# EAGLE board mcs-1-32 (EAGLE 6.5.0)
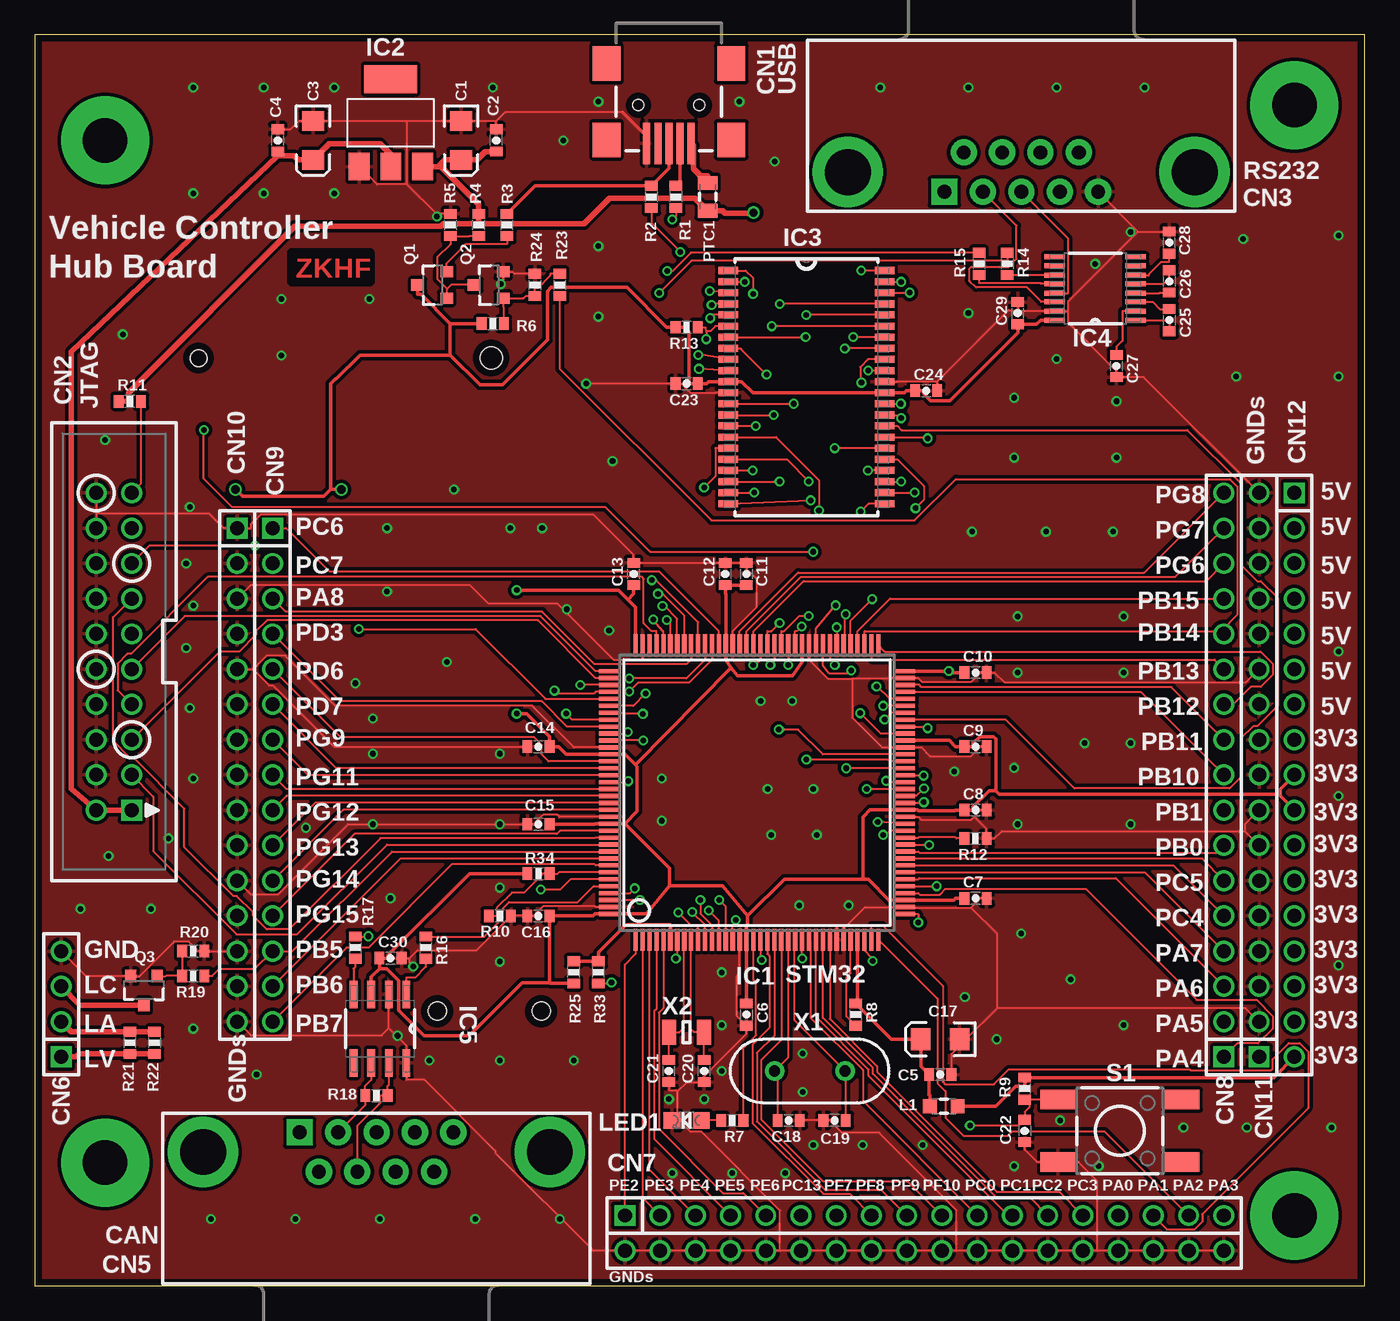
[diagram p2: board, top side]
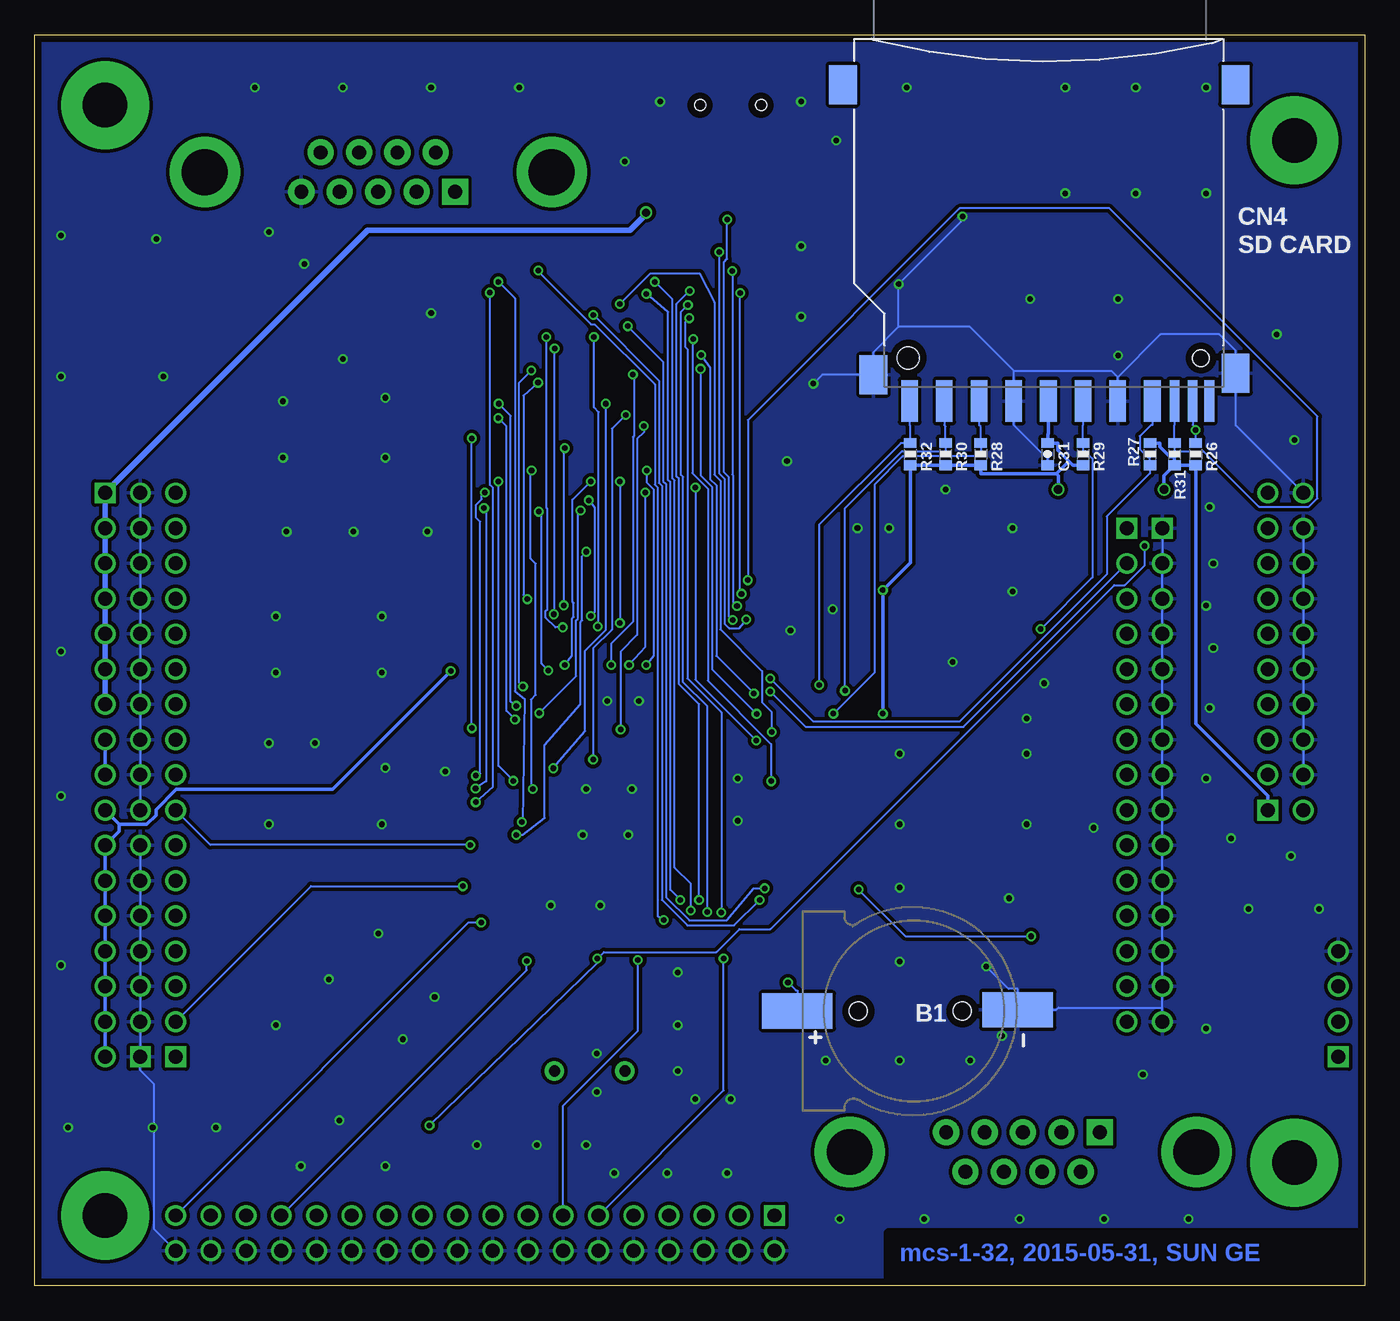
[diagram p3: board, bottom side, seen from below]

Size 95.89 x 90.17 mm. Coordinates in mm from the lower left corner, seen from the top.
Outline: 0,0 95.89,0 95.89,90.17 0,90.17 0,0
Copper layers (1*16): Top 0.035mm / dielectric 1.53mm / Bottom 0.035mm
Design rules "default": minimum track width 6mil, minimum drill 0.4mm, track to track 6mil, track to pad 6mil, pad to pad 6mil, via to via 6mil, smd to smd 5mil, copper to edge 0.5mm, drill to drill 0.5mm, minimum pad ring 0.15mm, minimum via ring 0.15mm, stop-mask expansion 4mil, vias tented up to drill 16mil, thermal gap 10mil
Net classes: 0 default: width 0.152 mm; 1 power_in: width 0.406 mm; 2 power: width 0.254 mm
tRestrict: 4 lines
bRestrict: 4 lines

## Footprints (pad centres in the part's own frame; a part is rotated, then mirrored left to right if it is on the bottom)
1220-SMD = smd 5.08 x 2.54: + 8.4,0; - -7.5,-0.1 | hole 1.3: 4,0; -3.5,0
EIA3216 = smd 1.4 x 1.6: A 1.4,0; C -1.4,0
0603-CAP = smd 0.7 x 0.9: 1 -0.8,0; 2 0.8,0
USB-MINIB = smd 3 x 0.5: D+ 2.75,0; D- 2.75,0.8; GND 2.75,-1.6; ID 2.75,-0.8; VBUS 2.75,1.6 | smd 2.5 x 2: GND@1 -3,-4.5; GND@2 -3,4.5; GND@3 2.5,4.5; GND@4 2.5,-4.5 | hole 0.8: 0,2.2; 0,-2.2
JTAG-ARM = drill 1 square: 1 -11.43,-1.27 | drill 1: 2 -11.43,1.27; 3 -8.89,-1.27; 4 -8.89,1.27; 5 -6.35,-1.27; 6 -6.35,1.27; 7 -3.81,-1.27; 8 -3.81,1.27; 9 -1.27,-1.27; 10 -1.27,1.27; 11 1.27,-1.27; 12 1.27,1.27; 13 3.81,-1.27; 14 3.81,1.27; 15 6.35,-1.27; 16 6.35,1.27; 17 8.89,-1.27; 18 8.89,1.27; 19 11.43,-1.27; 20 11.43,1.27
DB9 = drill 1 pad 1.88 square: 1 -5.54,-1.42 | drill 1 pad 1.88: 2 -2.77,-1.42; 3 0,-1.42; 4 2.77,-1.42; 5 5.54,-1.42; 6 -4.15,1.42; 7 -1.38,1.42; 8 1.38,1.42; 9 4.15,1.42 | drill 3.3 pad 5.08: G1 -12.5,0; G2 12.5,0
06132 = smd 1.2 x 3: 1 19.9,1; 2 17.4,1; 3 14.9,1; 4 12.4,1; 5 9.9,1; 6 7.4,1; 7 4.9,1; 9 22.4,1 | smd 0.7 x 3: 8 3.3,1; CD 2,1; WP 0.8,1 | smd 2 x 2.8: GP -1.1,-21.8; GP2 27.2,-21.8; GP3 25,-0.9; GP4 -1.1,-1 | hole 1.2: 1.4,-2.1 | hole 1.6: 22.5,-2.1
DB9_MALE = drill 1 pad 1.88 square: 1 5.54,-1.42 | drill 1 pad 1.88: 2 2.77,-1.42; 3 0,-1.42; 4 -2.77,-1.42; 5 -5.54,-1.42; 6 4.15,1.42; 7 1.38,1.42; 8 -1.38,1.42; 9 -4.15,1.42 | drill 3.3 pad 5.08: G1 -12.5,0; G2 12.5,0
1X04_NS = drill 1 square: 1 -3.81,0 | drill 1: 2 -1.27,0; 3 1.27,0; 4 3.81,0
2X18U = drill 1 square: 1 0,0 | drill 1: 2 2.54,0; 3 5.08,0; 4 7.62,0; 5 10.16,0; 6 12.7,0; 7 15.24,0; 8 17.78,0; 9 20.32,0; 10 22.86,0; 11 25.4,0; 12 27.94,0; 13 30.48,0; 14 33.02,0; 15 35.56,0; 16 38.1,0; 17 40.64,0; 18 43.18,0; 19 0,-2.54; 20 2.54,-2.54; 21 5.08,-2.54; 22 7.62,-2.54; 23 10.16,-2.54; 24 12.7,-2.54; 25 15.24,-2.54; 26 17.78,-2.54; 27 20.32,-2.54; 28 22.86,-2.54; 29 25.4,-2.54; 30 27.94,-2.54; 31 30.48,-2.54; 32 33.02,-2.54; 33 35.56,-2.54; 34 38.1,-2.54; 35 40.64,-2.54; 36 43.18,-2.54
1X17M1 = drill 1 square: 1 0,0 | drill 1: 2 2.54,0; 3 5.08,0; 4 7.62,0; 5 10.16,0; 6 12.7,0; 7 15.24,0; 8 17.78,0; 9 20.32,0; 10 22.86,0; 11 25.4,0; 12 27.94,0; 13 30.48,0; 14 33.02,0; 15 35.56,0; 16 38.1,0; 17 40.64,0
1X15M1 = drill 1 square: 1 0,0 | drill 1: 2 2.54,0; 3 5.08,0; 4 7.62,0; 5 10.16,0; 6 12.7,0; 7 15.24,0; 8 17.78,0; 9 20.32,0; 10 22.86,0; 11 25.4,0; 12 27.94,0; 13 30.48,0; 14 33.02,0; 15 35.56,0
SQFP-S-20X20-144 = smd 0.3 x 1.6: 1 -8.75,-10.6; 2 -8.25,-10.6; 3 -7.75,-10.6; 4 -7.25,-10.6; 5 -6.75,-10.6; 6 -6.25,-10.6; 7 -5.75,-10.6; 8 -5.25,-10.6; 9 -4.75,-10.6; 10 -4.25,-10.6; 11 -3.75,-10.6; 12 -3.25,-10.6; 13 -2.75,-10.6; 14 -2.25,-10.6; 15 -1.75,-10.6; 16 -1.25,-10.6; 17 -0.75,-10.6; 18 -0.25,-10.6; 19 0.25,-10.6; 20 0.75,-10.6; 21 1.25,-10.6; 22 1.75,-10.6; 23 2.25,-10.6; 24 2.75,-10.6; 25 3.25,-10.6; 26 3.75,-10.6; 27 4.25,-10.6; 28 4.75,-10.6; 29 5.25,-10.6; 30 5.75,-10.6; 31 6.25,-10.6; 32 6.75,-10.6; 33 7.25,-10.6; 34 7.75,-10.6; 35 8.25,-10.6; 36 8.75,-10.6; 73 8.75,10.6; 74 8.25,10.6; 75 7.75,10.6; 76 7.25,10.6; 77 6.75,10.6; 78 6.25,10.6; 79 5.75,10.6; 80 5.25,10.6; 81 4.75,10.6; 82 4.25,10.6; 83 3.75,10.6; 84 3.25,10.6; 85 2.75,10.6; 86 2.25,10.6; 87 1.75,10.6; 88 1.25,10.6; 89 0.75,10.6; 90 0.25,10.6; 91 -0.25,10.6; 92 -0.75,10.6; 93 -1.25,10.6; 94 -1.75,10.6; 95 -2.25,10.6; 96 -2.75,10.6; 97 -3.25,10.6; 98 -3.75,10.6; 99 -4.25,10.6; 100 -4.75,10.6; 101 -5.25,10.6; 102 -5.75,10.6; 103 -6.25,10.6; 104 -6.75,10.6; 105 -7.25,10.6; 106 -7.75,10.6; 107 -8.25,10.6; 108 -8.75,10.6 | smd 1.6 x 0.3: 37 10.6,-8.75; 38 10.6,-8.25; 39 10.6,-7.75; 40 10.6,-7.25; 41 10.6,-6.75; 42 10.6,-6.25; 43 10.6,-5.75; 44 10.6,-5.25; 45 10.6,-4.75; 46 10.6,-4.25; 47 10.6,-3.75; 48 10.6,-3.25; 49 10.6,-2.75; 50 10.6,-2.25; 51 10.6,-1.75; 52 10.6,-1.25; 53 10.6,-0.75; 54 10.6,-0.25; 55 10.6,0.25; 56 10.6,0.75; 57 10.6,1.25; 58 10.6,1.75; 59 10.6,2.25; 60 10.6,2.75; 61 10.6,3.25; 62 10.6,3.75; 63 10.6,4.25; 64 10.6,4.75; 65 10.6,5.25; 66 10.6,5.75; 67 10.6,6.25; 68 10.6,6.75; 69 10.6,7.25; 70 10.6,7.75; 71 10.6,8.25; 72 10.6,8.75; 109 -10.6,8.75; 110 -10.6,8.25; 111 -10.6,7.75; 112 -10.6,7.25; 113 -10.6,6.75; 114 -10.6,6.25; 115 -10.6,5.75; 116 -10.6,5.25; 117 -10.6,4.75; 118 -10.6,4.25; 119 -10.6,3.75; 120 -10.6,3.25; 121 -10.6,2.75; 122 -10.6,2.25; 123 -10.6,1.75; 124 -10.6,1.25; 125 -10.6,0.75; 126 -10.6,0.25; 127 -10.6,-0.25; 128 -10.6,-0.75; 129 -10.6,-1.25; 130 -10.6,-1.75; 131 -10.6,-2.25; 132 -10.6,-2.75; 133 -10.6,-3.25; 134 -10.6,-3.75; 135 -10.6,-4.25; 136 -10.6,-4.75; 137 -10.6,-5.25; 138 -10.6,-5.75; 139 -10.6,-6.25; 140 -10.6,-6.75; 141 -10.6,-7.25; 142 -10.6,-7.75; 143 -10.6,-8.25; 144 -10.6,-8.75
BURR-BROWN_SOT223 = smd 1.499 x 2.007: 1 -2.261,-3.15; 2 0.025,-3.15; 3 2.311,-3.15 | smd 3.81 x 2.007: 4 0,3.15
SOP80P1176X120-44N = smd 1.397 x 0.508: 1 -5.639,8.407; 2 -5.639,7.595; 3 -5.639,6.807; 4 -5.639,5.994; 5 -5.639,5.207; 6 -5.639,4.394; 7 -5.639,3.607; 8 -5.639,2.794; 9 -5.639,2.007; 10 -5.639,1.194; 11 -5.639,0.406; 12 -5.639,-0.406; 13 -5.639,-1.194; 14 -5.639,-2.007; 15 -5.639,-2.794; 16 -5.639,-3.607; 17 -5.639,-4.394; 18 -5.639,-5.207; 19 -5.639,-5.994; 20 -5.639,-6.807; 21 -5.639,-7.595; 22 -5.639,-8.407; 23 5.639,-8.407; 24 5.639,-7.595; 25 5.639,-6.807; 26 5.639,-5.994; 27 5.639,-5.207; 28 5.639,-4.394; 29 5.639,-3.607; 30 5.639,-2.794; 31 5.639,-2.007; 32 5.639,-1.194; 33 5.639,-0.406; 34 5.639,0.406; 35 5.639,1.194; 36 5.639,2.007; 37 5.639,2.794; 38 5.639,3.607; 39 5.639,4.394; 40 5.639,5.207; 41 5.639,5.994; 42 5.639,6.807; 43 5.639,7.595; 44 5.639,8.407
SOP65P640X120-16N = smd 1.473 x 0.356: 1 -2.921,2.286; 2 -2.921,1.626; 3 -2.921,0.965; 4 -2.921,0.33; 5 -2.921,-0.33; 6 -2.921,-0.965; 7 -2.921,-1.626; 8 -2.921,-2.286; 9 2.921,-2.286; 10 2.921,-1.626; 11 2.921,-0.965; 12 2.921,-0.33; 13 2.921,0.33; 14 2.921,0.965; 15 2.921,1.626; 16 2.921,2.286
SOIC127P600X175-8N = smd 1.981 x 0.559: 1 -2.464,1.905; 2 -2.464,0.635; 3 -2.464,-0.635; 4 -2.464,-1.905; 5 2.464,-1.905; 6 2.464,-0.635; 7 2.464,0.635; 8 2.464,1.905
L2012C = smd 1 x 1: 1 -1,0; 2 1,0
CHIPLED_0805 = smd 1.2 x 1.2: A 0,-1.05; C 0,1.05
PTC0805 = smd 1 x 1.4: 1 -1,0; 2 1,0
SOT23-3 = smd 0.8 x 0.9: 1 -0.95,-1; 2 0.95,-1; 3 0,1.1
0603-RES = smd 0.7 x 0.9: 1 -0.8,0; 2 0.8,0
SWITCH-TACT_SFKHHM = smd 2.5 x 1.4: 1 -4.475,2.25; 2 -4.475,-2.25; 3 4.475,2.25; 4 4.475,-2.25
HC49US = drill 0.8 pad 1.422: 1 -2.54,0; 2 2.54,0
CRYSTAL-32KHZ-3215 = smd 1 x 1.8: 1 -1.25,0; 2 1.25,0

## Placement (x,y rotation side)
B1  3V  [1220-SMD]  32.51,19.81 180 bottom
C1  10u  [EIA3216]  30.73,82.55 270 top
C2  100n  [0603-CAP]  33.27,82.55 90 top
C3  10u  [EIA3216]  20.07,82.55 270 top
C4  100n  [0603-CAP]  17.53,82.55 90 top
C5  100n  [0603-CAP]  65.28,15.24 0 top
C6  100n  [0603-CAP]  51.31,19.56 270 top
C7  100n  [0603-CAP]  67.82,27.94 0 top
C8  100n  [0603-CAP]  67.82,34.29 0 top
C9  100n  [0603-CAP]  67.82,38.86 0 top
C10  100n  [0603-CAP]  67.82,44.2 0 top
C11  100n  [0603-CAP]  51.31,51.31 90 top
C12  100n  [0603-CAP]  49.78,51.31 90 top
C13  100n  [0603-CAP]  43.18,51.31 90 top
C14  100n  [0603-CAP]  36.32,38.86 180 top
C15  100n  [0603-CAP]  36.32,33.27 180 top
C16  100n  [0603-CAP]  36.32,26.67 180 top
C17  10u  [EIA3216]  65.28,17.78 180 top
C18  22p  [0603-CAP]  54.36,11.94 180 top
C19  22p  [0603-CAP]  57.66,11.94 0 top
C20  10p  [0603-CAP]  48.26,15.49 90 top
C21  10p  [0603-CAP]  45.72,15.49 90 top
C22  100n  [0603-CAP]  71.37,11.18 270 top
C23  100n  [0603-CAP]  46.99,65.02 180 top
C24  100n  [0603-CAP]  64.26,64.52 0 top
C25  100n  [0603-CAP]  81.79,69.6 270 top
C26  100n  [0603-CAP]  81.79,72.39 270 top
C27  100n  [0603-CAP]  77.98,66.29 270 top
C28  100n  [0603-CAP]  81.79,75.18 90 top
C29  100n  [0603-CAP]  70.87,70.1 90 top
C30  100n  [0603-CAP]  25.65,23.62 0 top
C31  100n  [0603-CAP]  22.86,59.94 270 bottom
CN1  USBSMD  [USB-MINIB]  45.72,85.09 270 top
CN2  JTAG-ARM-HDR100  [JTAG-ARM]  5.71,45.72 90 top
CN3  RS232  [DB9]  71.12,80.26 0 top
CN4  SDMMC06132  [06132]  10.41,64.77 180 bottom
CN5  CAN  [DB9_MALE]  24.64,9.65 180 top
CN6  LED_E  [1X04_NS]  1.91,20.32 90 top
CN7  HEADER-2X18  [2X18U]  42.55,5.08 0 top
CN8  PINHD-1X17  [1X17M1]  85.72,16.51 90 top
CN9  HEADER-1X15M1  [1X15M1]  17.14,54.61 270 top
CN10  HEADER-1X15M1  [1X15M1]  14.61,54.61 270 top
CN11  PINHD-1X17  [1X17M1]  88.27,16.51 90 top
CN12  PINHD-1X17  [1X17M1]  90.81,57.15 270 top
IC1  [SQFP-S-20X20-144]  52.07,35.56 0 top
IC2  AMS1117-3.3  [BURR-BROWN_SOT223]  25.65,83.82 0 top
IC3  IS62WV51216BLL-55TLI  [SOP80P1176X120-44N]  55.63,64.77 0 top
IC4  MAX3232CPWR  [SOP65P640X120-16N]  76.45,71.88 180 top
IC5  SN65HVD230DR  [SOIC127P600X175-8N]  24.89,18.54 270 top
L1  FB/10uH  [L2012C]  65.53,12.95 180 top
LED1  GREEN  [CHIPLED_0805]  46.99,11.94 90 top
PTC1  [PTC0805]  48.51,78.49 90 top
Q1  [SOT23-3]  28.7,72.14 90 top
Q2  [SOT23-3]  32.77,72.14 90 top
Q3  [SOT23-3]  7.87,21.34 180 top
R1  22R  [0603-RES]  46.23,78.49 270 top
R2  22R  [0603-RES]  44.45,78.49 270 top
R3  1K5  [0603-RES]  34.04,76.45 90 top
R4  10K  [0603-RES]  32,76.45 90 top
R5  36K/39K  [0603-RES]  29.97,76.45 270 top
R6  47K  [0603-RES]  33.02,69.34 180 top
R7  470R  [0603-RES]  50.29,11.94 180 top
R8  47R  [0603-RES]  59.18,19.56 270 top
R9  10K  [0603-RES]  71.37,14.22 90 top
R10  10K  [0603-RES]  33.53,26.67 0 top
R11  0R  [0603-RES]  6.86,63.75 0 top
R12  10K  [0603-RES]  67.82,32.26 180 top
R13  10K  [0603-RES]  46.99,69.09 180 top
R14  0R  [0603-RES]  70.1,73.66 270 top
R15  0R  [0603-RES]  68.07,73.66 270 top
R16  0R  [0603-RES]  28.19,24.38 270 top
R17  1K  [0603-RES]  23.11,24.38 270 top
R18  120R  [0603-RES]  24.64,13.72 180 top
R19  2K2  [0603-RES]  11.43,22.35 180 top
R20  1K  [0603-RES]  11.43,24.13 180 top
R21  [0603-RES]  6.86,17.53 270 top
R22  [0603-RES]  8.64,17.53 270 top
R23  0R/NP  [0603-RES]  37.85,72.14 270 top
R24  0R/NP  [0603-RES]  36.07,72.14 90 top
R25  0R/NP  [0603-RES]  38.86,22.61 90 top
R26  10K  [0603-RES]  12.19,59.94 270 bottom
R27  10K  [0603-RES]  15.49,59.94 90 bottom
R28  10K  [0603-RES]  27.69,59.94 270 bottom
R29  10K  [0603-RES]  20.32,59.94 270 bottom
R30  10K  [0603-RES]  30.23,59.94 270 bottom
R31  10K  [0603-RES]  13.72,59.94 270 bottom
R32  10K  [0603-RES]  32.77,59.94 270 bottom
R33  0R/NP  [0603-RES]  40.64,22.61 90 top
R34  0R/NP  [0603-RES]  36.32,29.72 180 top
S1  [SWITCH-TACT_SFKHHM]  78.23,11.18 0 top
X1  8M  [HC49US]  55.88,15.49 180 top
X2  32768  [CRYSTAL-32KHZ-3215]  46.99,18.29 0 top

## Tracks (layer width: path | path; a pad name or v marks a point on that pad's centre or on a via)
!RST  (via drill 0.4 pad 0.7)
  Top 0.152: v15.88,53.34 8.26,53.34 CN2.15 | S1.1 72.06,13.43 72.05,13.42 71.71,13.42 | R9.1 71.71,13.42 | 71.71,13.42 71.71,12.89 71.37,12.55 71.37,12.18 C22.1 70.97,11.57 v67.42,11.57 | v55.32,23.6 IC1.25
  Bottom 0.152: v15.88,53.34 15.88,51.94 17.31,50.51 18.07,50.51 42.85,25.72 45.08,25.72 46.74,24.07 54.86,24.07 v55.32,23.6 55.32,23.29 v67.42,11.57
+5V  (via drill 0.6)
  Top 0.406: R11.1 6.76,63.75 6.76,64.37 18.75,76.35 29.29,76.35 29.49,76.55 32,76.55 | C2.1 32.47,81.75 31.89,81.17 31.89,81.15 C1.A 29.58,81.15 29.2,80.77 | 29.2,80.77 32,77.96 R4.2 32,76.55 | IC2.3 29.1,80.67 29.2,80.77 | 32,76.55 39.59,76.55 41.44,78.39 47.61,78.39 PTC1.1 49.57,77.49 49.75,77.31 51.78,77.31 v51.82,77.34
  Bottom 0.406: CN12.7 CN12.6 CN12.5 CN12.4 CN12.3 CN12.2 CN12.1 71.88,76.07 52.96,76.07 51.82,77.22 v51.82,77.34
A0  (via drill 0.4 pad 0.7)
  Top 0.152: IC1.10 47.82,25.99 47.33,25.99 v46.39,26.92 | IC3.5 48.94,69.98 v48.7,69.74
  Bottom 0.152: v48.7,69.74 48.99,69.45 48.99,67.67 48.84,67.51 48.84,43.78 46.39,41.34 v46.39,26.92
A1  (via drill 0.4 pad 0.7)
  Top 0.152: IC3.4 48.86,70.76 v48.8,70.7 | IC1.11 48.32,26.03 v47.4,26.95
  Bottom 0.152: v47.4,26.95 47.4,41.76 49.14,43.51 49.14,58.3 49.3,58.46 49.3,70.2 v48.8,70.7
A2  (via drill 0.4 pad 0.7)
  Top 0.152: v47.99,27.82 47.99,26.83 48.82,26 IC1.12 | IC3.3 v48.67,71.7
  Bottom 0.152: v47.99,27.82 47.99,41.92 49.45,43.38 49.45,58.17 49.6,58.33 49.6,70.77 v48.67,71.7
A3  (via drill 0.4 pad 0.7)
  Top 0.152: IC3.2 v51.18,72.36 | IC1.13 49.32,26.33 v48.58,27.07
  Bottom 0.152: v48.58,27.07 48.58,28.98 49.75,30.15 49.75,58.05 49.91,58.2 49.91,71.09 v51.18,72.36
A4  (via drill 0.4 pad 0.7)
  Top 0.152: IC3.1 51.25,73.18 51.79,72.64 v51.79,71.5 | IC1.14 49.82,27.34 v49.34,27.82
  Bottom 0.152: v49.34,27.82 50.06,28.54 50.06,57.92 50.21,58.08 50.21,70.18 v51.79,71.5
A5  (via drill 0.4 pad 0.7)
  Top 0.152: IC3.44 v59.57,73.18 | IC1.15 50.32,25.89 v50.54,26.37
  Bottom 0.152: v59.57,73.18 59.57,73.09 55.78,69.3 55.52,69.3 51.19,64.97 51.19,57.75 50.97,57.54 50.97,26.67 v50.54,26.37
A6  (via drill 0.4 pad 0.7)
  Top 0.152: IC1.50 v60.76,33.44 | IC3.43 v62.45,72.36
  Bottom 0.152: v62.45,72.36 61.27,71.17 61.27,42.87 60.57,42.3 60.7,33.37 v60.76,33.44
A7  (via drill 0.4 pad 0.7)
  Top 0.152: IC3.42 v63.07,71.58 | IC1.53 63.91,34.81 v64.09,34.87
  Bottom 0.152: v64.09,34.87 62.86,35.98 62.86,57.52 63.07,57.73 v63.07,71.58
A8  (via drill 0.4 pad 0.7)
  Top 0.152: IC3.27 62.19,59.56 64.09,57.66 64.09,56.64 v63.5,56.05 | v64.1,35.85 63.56,35.31 IC1.54
  Bottom 0.152: v63.5,56.05 63.34,55.89 63.34,36.36 v64.1,35.85
A9  (via drill 0.4 pad 0.7)
  Top 0.152: IC1.55 v59.98,35.81 | IC3.26 v60.07,58.78
  Bottom 0.152: v60.07,58.78 60.13,58.71 60.13,52.41 59.77,52.06 59.77,42.59 60.1,42.26 60.1,35.94 v59.98,35.81
A10  (via drill 0.4 pad 0.7)
  Top 0.152: IC1.56 61.47,36.31 v61.38,36.4 | IC3.25 v62.45,57.96
  Bottom 0.152: v61.38,36.4 62.45,37.48 v62.45,57.96
A11  (via drill 0.4 pad 0.7)
  Top 0.152: IC1.57 63.91,36.81 v64.07,36.77 | IC3.24 v63.44,57.17
  Bottom 0.152: v64.07,36.77 63.78,36.94 63.78,55.08 64.08,55.38 64.08,56.29 63.65,56.71 | 63.65,56.71 | 63.65,56.71 63.65,56.96 v63.44,57.17
A12  (via drill 0.4 pad 0.7)
  Top 0.152: IC1.87 53.82,47.19 54.02,47.19 55.12,48.29 v55.8,48.29 | IC3.22 v55.93,56.62
  Bottom 0.152: v55.93,56.62 55.53,56.09 55.53,48.56 v55.8,48.29
A13  (via drill 0.4 pad 0.7)
  Top 0.152: IC1.88 53.32,45.13 53.28,45.13 v53.03,44.75 | IC3.21 v51.87,57.17
  Bottom 0.152: v53.03,44.75 51.87,46.05 v51.87,57.17
A14  (via drill 0.4 pad 0.7)
  Top 0.152: IC1.89 52.82,47.19 53.1,47.19 v53.7,47.79 | IC3.20 v53.7,57.96
  Bottom 0.152: v53.7,57.96 v53.7,47.79
A15  (via drill 0.4 pad 0.7)
  Top 0.152: IC1.90 52.32,45.13 52.06,44.88 v51.8,44.75 | IC3.19 v51.76,58.78
  Bottom 0.152: v51.76,58.78 51.76,57.9 51.28,57.41 51.28,45.4 v51.8,44.75
A16  (via drill 0.4 pad 0.7)
  Top 0.152: IC1.80 57.32,45.13 57.42,45.13 v57.68,44.75 | IC3.18 54.21,59.56 v55.8,57.97
  Bottom 0.152: v57.68,44.75 57.15,45.41 57.15,48.09 57.03,48.21 57.03,49.21 57.11,49.3 57.11,56.66 v55.8,57.97
A17  (via drill 0.4 pad 0.7)
  Top 0.152: IC3.23 60.12,56.36 v59.55,55.8 | 58.66,44.29 v58.85,44.36 58.66,44.16 57.27,44.16 56.82,44.73 IC1.81
  Bottom 0.152: v58.85,44.36 59.35,44.85 59.35,55.59 v59.55,55.8
A18  (via drill 0.4 pad 0.7)
  Top 0.152: IC1.82 56.32,47.38 v57.74,49.05 | IC3.28 v57.68,60.38
  Bottom 0.152: v57.74,49.05 57.74,60.06 v57.68,60.38
D0  (via drill 0.4 pad 0.7)
  Top 0.152: IC1.85 54.82,47.19 54.94,47.19 v55.29,47.53 | IC3.7 v55.57,68.38
  Bottom 0.152: v55.29,47.53 55.22,47.6 55.22,62.97 55.57,63.31 v55.57,68.38
D1  (via drill 0.4 pad 0.7)
  Top 0.152: IC3.8 50.91,67.56 50.91,67.52 v52.76,65.68 | IC1.86 54.32,44.88 v54.32,44.75
  Bottom 0.152: v52.76,65.68 52.66,65.59 52.66,61.25 52.76,61.16 52.76,47.86 54.32,46.3 v54.32,44.75
D2  (via drill 0.4 pad 0.7)
  Top 0.152: v44.04,42.7 43.15,41.81 IC1.114 | IC3.9 47.89,67.16 v47.84,67.08
  Bottom 0.152: v47.84,67.08 47.19,66.18 47.19,58.15 46.75,57.71 46.75,45.41 v44.04,42.7
D3  (via drill 0.4 pad 0.7)
  Top 0.152: IC1.115 42.5,41.31 42.58,41.23 v43.85,41.23 | IC3.10 v47.89,66.09
  Bottom 0.152: v47.89,66.09 47.89,58.41 47.06,57.59 47.06,44.45 v43.85,41.23
D4  (via drill 0.4 pad 0.7)
  Top 0.152: IC3.13 v54.71,63.58 | IC1.58 v58.5,37.31
  Bottom 0.152: v58.5,37.31 56.21,39.98 56.21,45.79 54.71,47.29 v54.71,63.58
D5  (via drill 0.4 pad 0.7)
  Top 0.152: IC1.59 61.64,37.81 61.52,37.93 v55.63,37.93 | IC3.14 v53.28,62.76
  Bottom 0.152: v53.28,62.76 54.27,61.77 54.27,47.3 55.63,45.94 v55.63,37.93
D6  (via drill 0.4 pad 0.7)
  Top 0.152: IC1.60 56.82,38.31 55.03,40.1 v53.65,40.1 | IC3.15 v51.97,61.98
  Bottom 0.152: v51.97,61.98 51.97,61.52 52.45,61.04 52.45,46.92 53.65,45.72 v53.65,40.1
D7  (via drill 0.4 pad 0.7)
  Top 0.152: IC3.16 53.44,61.16 56.53,58.07 v56.53,55.88 | IC1.63 60.99,39.81 v59.52,41.28
  Bottom 0.152: v59.52,41.28 56.85,43.95 | 56.85,43.95 | 56.85,43.95 56.85,47.96 56.73,48.08 56.73,55.69 v56.53,55.88
D8  (via drill 0.4 pad 0.7)
  Top 0.152: IC1.64 64.27,40.31 v64.38,40.2 | IC3.29 64.3,61.16 v64.38,61.08
  Bottom 0.152: v64.38,40.2 v64.38,61.08
D9
  Top 0.152: IC3.30 62.19,61.98 62.49,61.68 83.11,61.68 87.02,57.77 87.02,51.91 88.12,50.8 88.39,50.8 89.61,49.59 89.61,41.82 88.13,40.35 87.85,40.35 87,39.5 87,36.71 86.14,35.85 74.96,35.85 70,40.81 IC1.65
D10  (via drill 0.4 pad 0.7)
  Top 0.152: IC1.66 61.64,41.31 61.64,41.2 v61.26,40.83 | IC3.31 62.23,62.76 v62.45,62.54
  Bottom 0.152: v61.26,40.83 61.88,41.44 61.88,61.96 v62.45,62.54
D11  (via drill 0.4 pad 0.7)
  Top 0.152: IC3.32 v62.44,63.58 | IC1.67 v61.17,41.81
  Bottom 0.152: v61.17,41.81 61.57,42.08 61.57,62.71 v62.44,63.58
D12  (via drill 0.4 pad 0.7)
  Top 0.152: IC3.35 v60.09,65.96 | IC1.68 61.64,42.31 60.76,43.2 v60.69,43.2
  Bottom 0.152: v60.69,43.2 60.96,43.47 60.96,65.09 v60.09,65.96
D13  (via drill 0.4 pad 0.7)
  Top 0.152: IC1.77 58.82,47.95 v60.37,49.49 | IC3.36 60.07,66.78 59.51,66.22 59.51,65.31 v59.6,65.09
  Bottom 0.152: v59.6,65.09 60.65,64.16 60.65,49.78 v60.37,49.49
D14  (via drill 0.4 pad 0.7)
  Top 0.152: IC3.37 v58.41,67.56 | IC1.78 58.41,46.25 58.41,48.35 v58.46,48.41
  Bottom 0.152: v58.46,48.41 58.41,48.46 v58.41,67.56
D15  (via drill 0.4 pad 0.7)
  Top 0.152: v57.82,47.47 IC1.79 | IC3.38 v59,68.38
  Bottom 0.152: v57.82,47.47 58.34,47.47 59.04,48.17 59.04,48.65 58.93,48.76 58.93,56 59,56.07 v59,68.38
FSMC_NBL0  (via drill 0.4 pad 0.7)
  Top 0.152: IC1.141 42.91,28.31 v43.26,28.66 | IC3.39 v53.14,69.16
  Bottom 0.152: v53.14,69.16 50.58,66.6 50.58,58.01 50.36,57.79 50.36,28.01 48.69,26.34 45.98,26.34 44.04,28.66 v43.26,28.66
FSMC_NBL1  (via drill 0.4 pad 0.7)
  Top 0.152: IC1.142 42.5,27.81 v43.63,27.81 | IC3.40 v55.62,69.98
  Bottom 0.152: v55.62,69.98 50.88,65.24 50.88,57.88 50.67,57.67 50.67,27.82 48.84,25.98 45.46,25.98 v43.63,27.81
FSMC_NE3  (via drill 0.4 pad 0.7)
  Top 0.152: R13.1 48.37,69.09 48.37,68.92 48.47,68.82 | IC1.125 42.5,36.31 42.57,36.38 v42.79,36.38 | IC3.6 49.06,69.16 48.71,68.82 48.47,68.82 | 48.47,68.82 48.41,68.76 v48.41,68.23
  Bottom 0.152: v48.41,68.23 48.47,68.17 48.47,58.57 47.36,57.46 47.36,43.62 | 47.36,43.62 | 47.36,43.62 42.79,39.04 v42.79,36.38
FSMC_NOE  (via drill 0.4 pad 0.7)
  Top 0.152: IC1.118 42.65,39.81 v42.76,39.93 | IC3.41 v53.7,70.76
  Bottom 0.152: v53.7,70.76 51.5,72.96 47.95,72.96 46.89,70.88 46.89,58.48 46.45,58.04 46.45,47.31 43.45,44.31 43.45,42.07 42.76,41.38 v42.76,39.93
FSMC_NWE  (via drill 0.4 pad 0.7)
  Top 0.152: IC3.17 49.06,60.38 49.06,58.34 v48.25,57.53 | v43.88,39.31 IC1.119
  Bottom 0.152: v48.25,57.53 48.25,43.69 v43.88,39.31
GND  (via drill 0.4, 0.4 pad 0.7)
  Top 0.152: 26.82,79.39 28.96,77.25 29,77.25 | 26.82,83.95 26.82,79.39 | 26.82,79.39 24.67,79.39 IC2.1 | 26.82,83.95 C3.C 19.04,83.95 18.44,83.35 C4.2 | 26.82,83.95 C1.C 33.25,83.95 33.27,83.93 | R5.1 29,77.25 | 29,77.25 v29,77.06 | 25.53,18.57 IC5.2 | CN10.15 15.6,18.06 25.02,18.06 25.53,18.57 | 25.53,18.57 26.8,17.3 IC5.8 26.8,14.86 28.1,14.86 33.24,9.72 33.24,9.58 40.28,2.54 CN7.19 CN7.20 CN7.21 CN7.22 CN7.23 53.74,2.54 | IC3.34 62.19,65.18 62.21,65.19 65.06,65.19 | IC3.12 49.06,64.36 49.04,64.34 47.3,64.34 46.77,64.88 46.77,65.02 C23.2 v39.75,65.02 | C5.2 66.08,16.72 66.68,17.32 C17.C 67.14,17.78 69.39,20.03 | IC1.30 57.82,25.99 58.1,25.99 58.32,25.77 | IC1.143 40.44,27.31 40.4,27.35 36.63,27.35 36.1,26.82 36.1,26.67 C16.2 R10.2 31.86,24.2 27.61,24.2 27.03,23.62 | C9.2 68.04,38.86 68.04,38.72 67.5,38.18 64.54,38.18 63.91,38.81 IC1.61 61.09,38.81 58.94,40.96 58.94,43.78 | C8.2 68.04,34.29 68.04,34.15 67.72,33.83 | CN6.4 3.7,22.34 Q3.2 7.55,22.34 10.04,24.82 11.1,24.82 11.65,24.27 11.65,24.13 R20.1 CN10.13 | IC1.83 55.82,45.13 57.18,43.78 58.94,43.78 | IC1.107 43.82,45.13 41.73,45.13 37.67,49.19 32.69,49.19 31.36,50.52 15.59,50.52 CN10.3 | IC1.94 50.32,47.19 52.02,48.89 52.02,50.96 51.45,51.53 51.31,51.53 C11.2 C12.2 C13.2 43.18,52.69 40.28,55.59 16.29,55.59 15.58,54.88 15.58,54.61 CN10.1 13.63,54.61 12.59,55.64 4.45,55.64 | 87.24,32.78 CN11.7 | CN11.8 87.24,33.26 87.24,32.78 | 66.44,2.54 CN7.28 CN7.27 CN7.26 CN7.25 CN7.24 53.74,2.54 | 66.44,2.54 CN7.29 CN7.30 CN7.31 CN7.32 76.6,2.54 | CN11.12 87.29,43.47 69.92,43.47 69.2,44.2 C10.2 68.04,44.2 68.04,44.05 67.5,43.52 63.99,43.52 63.7,43.81 IC1.71 61.64,43.81 61.61,43.78 58.94,43.78
  Top 0.152: IC1.16 50.82,22.53 50.63,22.34 50.63,19.44 C6.2 51.31,18.18 48.26,15.13 C20.1 47.02,14.69 46.35,14.03 | v27.28,23.02 27.03,23.26 27.03,23.62 | 42.39,84.58 33.92,84.58 33.27,83.93 | C2.2 33.27,83.93 | C30.2 27.03,23.62 | 76.6,2.54 CN7.33 CN7.34 CN7.35 CN7.36 | IC1.130 37.82,33.81 37.66,33.97 36.65,33.97 36.1,33.42 36.1,33.27 C15.2 22.59,33.27 17.55,28.23 15.59,28.23 CN10.11 | 87.24,32.78 69.71,32.78 69.2,32.26 R12.1 68.62,32.94 67.72,33.83 | CN2.20 4.45,55.64 | 4.45,55.64 CN2.18 | C21.1 45.72,14.12 46.26,14.12 46.35,14.03 | 53.74,2.54 53.74,5.43 48.06,11.11 47.29,11.11 46.77,11.63 46.77,11.94 46.35,11.94 | 46.35,11.94 46.35,14.03 | LED1.C 46.35,11.94 | v33.6,72.19 33.77,72.35 Q2.2 34.45,73.09 34.59,72.94 R24.2 | 66.44,2.54 66.44,5.47 60.86,11.05 58.18,11.05 57.44,11.79 57.44,11.94 C19.1 C18.1 | IC1.31 58.32,25.77 | C24.2 65.06,65.19 | 70.87,70.33 70.94,70.26 IC4.15 74.5,70.26 | C29.2 70.87,70.33 | 65.06,65.19 70.19,70.33 70.87,70.33 | 76.6,2.54 76.6,7.57 75.24,8.93 S1.2 72.28,8.93 71.41,9.8 71.37,9.8 C22.2 | CN11.17 79.92,65.49 C27.2 77.98,66.07 77.83,66.07 74.5,69.41 74.5,70.26 | CN3.5 79.52,75.98 | 79.52,75.98 C28.2 | 74.5,70.26 74.5,70.96 79.52,75.98 | CN10.5 15.73,44.45 | 15.73,44.45 16.89,43.29 17.15,43.29 21.58,38.86 C14.2 | IC1.51 63.7,33.81 63.9,33.61 67.5,33.61 67.72,33.83 | 58.32,25.77 59.86,27.31 IC1.38 62.72,27.26 67.5,27.26 | C7.2 68.04,27.94 68.04,27.8 67.5,27.26 | 69.39,20.03 69.39,25.38 67.5,27.26 | CN11.2 87.29,20.03 69.39,20.03 | IC1.120 38.88,38.81 35.87,41.82 21.67,41.82 18.06,45.43 16.72,45.43 15.73,44.45
  Top 0.254: CN1.GND 44.12,82.85 42.39,84.58
  Bottom 0.152: v39.75,65.02 39.1,65.67 CN4.GP3 35.41,67.3 33.6,69.11 | 25.31,65.95 28.47,69.11 33.6,69.11 | 25.31,65.95 CN4.3 25.31,62.03 23,59.72 22.86,59.72 C31.2 | 25.31,65.95 18.27,65.95 17.81,65.5 | CN4.6 17.81,65.5 | 17.81,65.5 14.73,68.58 10.49,68.58 9.31,67.4 CN4.GP4 9.31,62.02 CN2.20 | 14.61,20.07 CN10.14 CN10.13 CN10.12 CN10.11 CN10.10 CN10.9 CN10.8 CN10.7 CN10.6 CN10.5 CN10.4 CN10.3 CN10.2 CN10.1 | CN2.4 CN2.6 CN2.8 CN2.10 CN2.12 CN2.14 CN2.16 CN2.18 | CN10.15 14.61,20.07 | CN11.7 CN11.6 CN11.5 CN11.4 CN11.3 CN11.2 CN11.1 88.27,15.53 87.29,14.55 87.29,4.1 CN7.36 | CN11.8 CN11.9 CN11.10 CN11.11 CN11.12 CN11.13 CN11.14 CN11.15 CN11.16 CN11.17 | 14.61,20.07 22.09,20.07 22.24,19.91 B1.- 25.01,21.41 25.68,21.41 v27.28,23.02 | 33.6,69.11 v33.6,72.19 29,76.79 v29,77.06
  other vias: 11.43,78.74 21.59,78.74 16.51,78.74 11.43,86.36 16.51,86.36 21.59,86.36 33.02,86.36 40.64,85.34 38.1,82.55 50.8,85.34 40.64,74.93 60.96,86.36 67.31,86.36 73.66,86.36 80.01,86.36 17.78,71.12 24.13,71.12 40.64,69.85 6.35,68.58 5.08,60.96 25.4,54.61 34.29,54.61 36.58,54.61 25.4,50.04 29.72,44.96 23.11,43.43 38.35,48.77 41.4,47.24 10.92,52.07 11.18,56.13 11.43,49.02 10.92,45.97 11.18,41.66 11.43,36.58 9.65,32.26 5.33,30.99 24.38,40.89 24.38,38.35 33.53,38.35 19.56,33.02 24.38,33.27 33.53,33.27 25.65,27.94 33.53,28.7 33.53,23.37 33.53,16.26 37.85,4.83 12.7,4.83 18.8,4.83 24.89,4.83 31.75,4.83 28.45,16.26 26.16,18.03 3.3,27.18 11.43,18.54 45.97,8.13 50.29,8.13 54.1,8.13 45.72,13.46 48.26,13.46 49.53,22.61 49.53,18.8 49.53,15.49 55.37,16.76 55.37,13.97 56.13,10.16 59.69,10.16 64.01,10.16 70.61,8.64 76.71,8.64 73.91,11.94 82.8,11.43 87.38,11.43 93.47,11.43 93.98,23.11 93.98,35.31 93.98,45.72 69.34,17.78 67.06,20.83 71.12,25.4 74.68,22.1 78.49,18.8 66.29,37.08 70.87,33.27 78.99,33.27 70.61,37.34 75.69,39.12 78.99,39.12 70.87,44.2 78.49,44.2 70.87,48.26 78.49,48.26 67.56,54.36 72.9,54.36 77.72,54.36 70.61,59.69 77.98,59.69 77.98,63.75 76.45,73.66 73.66,66.8 70.61,64.01 67.31,70.1 93.98,65.53 86.61,65.53 87.12,75.44 93.98,75.69 53.34,81.03 78.99,75.95 41.66,59.44 38.86,16.26 17.78,67.06 30.23,57.4 8.38,27.18 16,15.24 45.21,36.58 45.21,33.53 52.83,35.81 56.13,35.81 53.09,32.51 56.39,32.51 55.12,27.43 58.67,27.43 52.32,42.16 54.61,42.16
  pour Bottom (isolate 0.254): 0,90.17 0,0 96.52,0 96.52,90.17
  pour Top (isolate 0.254): 0,90.17 0,0 95.25,0 95.25,90.17
N$1
  Top 0.152: Q1.2 29.7,73.72 31.06,75.08 34.04,75.08 R3.1
N$2
  Top 0.152: R4.1 31.32,75.65 R5.2 29.97,75.08 29.02,74.13 29.02,72.57 29.74,71.86 | 29.74,71.86 29.7,71.81 Q1.1 | Q2.3 30.02,72.14 29.74,71.86
N$3
  Top 0.152: R23.1 37.17,72.94 37.17,72.81 36.27,71.92 36.07,71.92 R24.1 35.39,71.34 35.24,71.19 Q2.1 33.77,70.56 33.82,70.5 R6.1
N$4
  Top 0.254: 46.52,79.29 R1.1 46.52,79.58 CN1.D-
N$5
  Top 0.254: R3.2 36.07,79.29 R2.1 45.72,80.56 CN1.D+
N$6
  Top 0.152: R7.1 51.09,17.17 52.01,18.08 52.01,21.87 51.82,22.06 IC1.18
N$7
  Top 0.152: R7.2 LED1.A
N$8
  Top 0.152: R8.2 58.5,19.44 58.5,22.23 58.82,22.54 IC1.32
N$9
  Top 0.152: R10.1 33.31,26.67 33.31,27.25 34.41,28.35 35.28,28.35 36.54,29.61 36.54,29.72 R34.1 37.7,29.72 37.79,29.81 IC1.138
N$10
  Top 0.152: R12.2 66.44,32.26 66.33,32.36 63.75,32.36 63.7,32.31 IC1.48
N$11  (via drill 0.4 pad 0.7)
  Top 0.152: R33.1 41.52,21.81 v41.58,21.87
  Bottom 0.152: v41.58,21.87 41.02,21.31 40.91,21.31 B1.+
N$12
  Top 0.152: C18.2 53.56,15.28 X1.2 54.32,16.47 IC1.23
N$13
  Top 0.152: IC1.24 54.74,24.88 54.74,19.17 X1.1 58.46,15.46 C19.2
N$14
  Top 0.152: C20.2 48.26,18.27 X2.2 47.51,18.29 47.32,18.48 IC1.9
N$15
  Top 0.152: C21.2 45.72,18.27 X2.1 46.47,18.29 46.82,18.64 IC1.8
N$16
  Top 0.152: R11.2 7.66,57.82 CN2.19
N$17
  Top 0.152: IC4.11 72.57,72.85 72.56,72.86 R14.2
N$18
  Top 0.152: IC4.12 72.57,72.21 72.5,72.28 68.07,72.28 R15.2
N$19
  Top 0.406: PTC1.2 48.51,80.01 48.01,80.01 47.5,80.52 47.5,82.16 CN1.VBUS
N$20
  Top 0.152: IC4.14 72.57,70.92 71.53,71.96 67.85,71.96 67.39,72.42 67.39,73.31 67.52,73.44 70.21,73.44 70.78,74.01 70.78,76.41 CN3.2
N$21
  Top 0.152: IC4.13 74.5,71.55 74.5,75.47 CN3.3
N$22
  Top 0.152: R16.2 28.19,23 27.41,22.23 26.8,22.23 IC5.1
N$23
  Top 0.152: IC4.1 81.57,69.6 81.79,69.38 C25.2
N$24
  Top 0.152: IC4.3 80.59,70.92 81.11,70.4 C25.1
N$25
  Top 0.152: IC4.4 81.07,71.55 81.11,71.59 C26.2
N$26
  Top 0.152: IC4.5 81.39,72.21 81.79,72.61 C26.1
N$27
  Top 0.152: IC4.2 78.41,70.26 78.41,68.1 77.98,67.67 C27.1
N$28
  Top 0.152: IC4.6 80.34,72.85 80.34,72.94 81.21,73.81 81.79,73.81 C28.1
N$29
  Top 0.152: R17.2 23.11,23 22.99,22.88 IC5.4
N$30
  Top 0.152: IC5.6 24.26,14.86 23.84,14.44 R18.2 23.84,13.38 23.84,13.04 23.83,13.04 CN5.2
N$31
  Top 0.152: IC5.7 25.53,14.48 25.44,14.39 R18.1 24.86,13.72 24.86,13.14 23.26,11.54 CN5.7
N$32
  Top 0.152: Q3.1 9.45,22.34 9.47,22.35 R19.2 R20.2
N$33  (via drill 3.2 pad 6.35)
  other vias: 5.08,8.89
N$34
  Top 0.406: CN6.1 3.01,16.51 3.23,16.73 R21.2 R22.2
N$35
  Top 0.406: CN6.2 2.63,18.33 R21.1 R22.1
N$36
  Top 0.406: Q3.3 3.26,20.24 CN6.3
N$37  (via drill 3.2 pad 6.35)
  other vias: 90.81,5.08
N$38  (via drill 3.2 pad 6.35)
  other vias: 90.81,85.09
N$39  (via drill 3.2 pad 6.35)
  other vias: 5.08,82.55
PA0  (via drill 0.4 pad 0.7)
  Top 0.152: IC1.34 59.82,24.18 60.33,23.67 v60.42,23.42
  Bottom 0.152: CN7.15 60.42,22.77 v60.42,23.42
PA1
  Top 0.152: IC1.35 60.32,25.99 61.1,25.99 65.46,21.63 65.46,14.71 65.63,14.54 69.16,14.54 70.23,15.61 83.26,15.61 83.34,15.53 89.11,15.53 89.24,15.66 89.24,16.35 90.4,17.51 91.19,17.51 91.8,16.89 91.8,12.81 84.16,5.17 84.16,4.63 83.6,4.07 81.66,4.07 CN7.16
PA2
  Top 0.152: IC1.36 65.08,20.7 65.08,14.62 65.66,14.04 65.66,12.13 67,10.79 70.1,10.79 70.43,11.12 77.14,11.12 CN7.17
PA3  (via drill 0.4 pad 0.7)
  Top 0.152: v63.7,26.2 63.7,26.81 IC1.37
  Bottom 0.152: CN7.18 64.61,26.2 v63.7,26.2
PA4
  Top 0.152: IC1.40 63.7,28.31 63.8,28.21 65.25,28.21 65.66,28.62 75.76,28.62 83.77,20.61 88.09,20.61 89.25,19.46 89.25,18.55 88.19,17.49 86.7,17.49 CN8.1
PA5  (via drill 0.4 pad 0.7)
  Top 0.152: IC1.41 v65.01,28.81
  Bottom 0.152: CN8.2 75.97,28.81 v65.01,28.81
PA6
  Top 0.152: IC1.42 63.7,29.31 63.78,29.39 77.93,29.39 CN8.3
PA7
  Top 0.152: IC1.43 80.05,29.81 CN8.4
PA8
  Top 0.152: IC1.100 47.32,45.13 47.01,44.82 40.37,44.82 36.59,48.59 18.09,48.59 CN9.3
PA9  (via drill 0.4 pad 0.7)
  Top 0.152: R14.1 70.1,73.88 47.35,73.88 v45.02,71.55 | v44.93,49.88 45.27,49.88 46.82,48.33 IC1.101
  Bottom 0.152: v45.02,71.55 45.06,71.51 45.06,50.01 v44.93,49.88
PA10  (via drill 0.4 pad 0.7)
  Top 0.152: IC1.102 46.32,48.08 45.39,49 v45.26,49 | R15.1 47.3,74.46 45.98,73.14 v45.6,73.14
  Bottom 0.152: v45.6,73.14 45.6,58.48 45.53,58.42 45.53,49.28 v45.26,49
PA11  (via drill 0.4 pad 0.7)
  Top 0.152: R1.2 46.23,77.11 46.22,77.11 v45.97,76.85 | IC1.103 45.82,47.74 v45.56,47.99
  Bottom 0.152: v45.56,47.99 45.84,48.27 45.84,58.29 46.2,58.66 46.2,73.77 45.97,74.01 v45.97,76.85
PA12  (via drill 0.4 pad 0.7)
  Top 0.152: IC1.104 45.32,47.19 45.3,47.19 v44.59,48.03 | R2.2 44.45,76.61 v46.55,74.52
  Bottom 0.152: v46.55,74.52 46.55,58.57 46.14,58.16 46.14,47.72 45.83,47.4 45.09,47.4 v44.59,48.03
PA13
  Top 0.152: IC1.105 44.82,47.19 44.48,47.19 43.9,47.76 43.9,50.96 43.77,51.09 12.48,51.09 6.95,45.55 6.68,45.55 5.98,44.85 5.98,42.92 CN2.7
PA14
  Top 0.152: IC1.109 40.44,44.31 36.48,48.28 10.81,48.28 CN2.9
PA15
  Top 0.152: IC1.110 40.44,43.81 36.28,47.97 16.74,47.97 15.98,47.21 15.98,46.96 14.74,45.72 13.34,45.72 CN2.5
PB0
  Top 0.152: IC1.46 63.7,31.31 63.8,31.2 85.18,31.2 CN8.7
PB1  (via drill 0.4 pad 0.7)
  Top 0.152: IC1.47 64.46,31.81 v64.48,31.78
  Bottom 0.152: v64.48,31.78 83.22,31.78 CN8.8
PB3
  Top 0.152: IC1.133 40.44,32.31 40.4,32.27 24.92,32.27 18.35,25.69 16.73,25.69 15.73,26.68 15.73,26.93 14.57,28.09 14.33,28.09 10.79,31.63 10.79,34.41 7.1,38.1 6.83,38.1 5.65,39.28 5.65,48.19 CN2.13
PB4
  Top 0.152: CN2.3 8.55,35.27 8.55,31.34 14.55,25.33 18.91,25.33 25.39,31.81 IC1.134
PB5
  Top 0.152: R19.1 12.81,22.35 13.32,22.86 15.88,22.86 CN9.13 18.57,24.13 25.75,31.31 IC1.135
PB6
  Top 0.152: CN9.14 26.36,30.81 IC1.136
PB7
  Top 0.152: IC1.137 40.44,30.31 40.35,30.4 30.07,30.4 24.06,24.39 22.48,24.39 CN9.15
PB8  (via drill 0.4 pad 0.7)
  Top 0.152: R17.1 24.04,25.18 v24.06,25.2 | IC1.139 38.62,29.31 37.87,28.57 v36.49,28.57
  Bottom 0.152: v36.49,28.57 33.13,25.2 v24.06,25.2
PB9
  Top 0.152: R16.1 32.41,25.18 33.75,26.52 33.75,27.21 34.19,27.65 39.15,27.65 40.3,28.81 IC1.140
PB10
  Top 0.152: IC1.69 79.75,42.81 CN8.9
PB11
  Top 0.152: CN8.10 81.95,43.15 63.93,43.15 63.77,43.31 IC1.70
PB12
  Top 0.152: IC1.73 61.26,45.72 88.38,45.72 89.25,44.85 89.25,44.04 88.39,43.18 87.67,43.18 86.4,41.91 CN8.11
PB13
  Top 0.152: IC1.74 60.32,45.13 85.04,45.13 CN8.12
PB14
  Top 0.152: IC1.75 59.82,47.19 85.53,47.19 | 85.53,47.19 CN8.13 | R23.2 37.85,66.1 48.78,55.17 63.43,55.17 66.41,58.15 86.16,58.15 86.71,57.6 86.71,48.37 85.53,47.19
PB15
  Top 0.152: IC1.76 59.32,47.19 61.66,49.53 CN8.14
PC0
  Top 0.152: IC1.26 55.94,24.84 55.94,19.34 59.69,15.58 59.69,13.33 CN7.11
PC1
  Top 0.152: CN7.12 70.19,5.08 60.11,15.17 60.11,15.6 56.32,19.39 IC1.27
PC2
  Top 0.152: CN7.13 71.73,6.38 69.33,6.38 60.41,15.29 60.41,15.73 56.82,19.32 IC1.28
PC3
  Top 0.152: IC1.29 | IC1.29 57.32,19.25 60.72,15.85 60.72,15.43 69.36,6.79 73.86,6.79 CN7.14
PC4
  Top 0.152: IC1.44 82.08,30.31 CN8.5
PC5
  Top 0.152: IC1.45 84.12,30.81 CN8.6
PC6
  Top 0.152: CN9.1 18.12,54.61 21.25,51.48 45.03,51.48 49.32,47.19 IC1.96
PC7  (via drill 0.4 pad 0.7)
  Top 0.152: IC1.97 48.82,45.13 47.17,43.48 43.5,43.48 v42.87,42.84
  Bottom 0.152: v42.87,42.84 40.31,40.29 28.93,40.29 CN9.2
PC13  (via drill 0.4 pad 0.7)
  Top 0.152: IC1.7 46.32,23.7 v46.23,23.61
  Bottom 0.152: CN7.6 46.23,14.1 v46.23,23.61
PD3
  Top 0.152: IC1.117 38.39,40.31 36.57,42.13 22.01,42.13 CN9.4
PD6
  Top 0.152: IC1.122 37.04,37.81 36.54,38.3 36.54,39 36,39.54 22.05,39.54 CN9.5
PD7
  Top 0.152: IC1.123 21.75,37.31 CN9.6
PE2
  Top 0.152: IC1.1 43.32,23.93 42.55,23.16 CN7.1
PE3
  Top 0.152: IC1.2 43.82,6.34 CN7.2
PE4
  Top 0.152: CN7.3 44.32,8.38 IC1.3
PE5
  Top 0.152: IC1.4 44.82,19.96 44.65,19.78 44.65,10.6 CN7.4
PE6
  Top 0.152: IC1.5 45.32,20.02 44.99,19.7 44.99,11.32 49.62,6.7 51.09,6.7 CN7.5
PF7  (via drill 0.4 pad 0.7)
  Top 0.152: IC1.19 52.32,23.56 v52.4,23.48
  Bottom 0.152: CN7.7 57.78,12.99 52.4,18.38 v52.4,23.48
PF8
  Top 0.152: IC1.20 52.82,23.93 52.98,23.77 52.98,18.62 51.76,17.4 51.76,11.74 56.85,6.64 58.76,6.64 CN7.8
PF9
  Top 0.152: IC1.21 53.32,18.05 52.06,16.79 52.06,11.86 56.98,6.95 61,6.95 CN7.9
PF10
  Top 0.152: IC1.22 53.82,17.74 52.37,16.28 52.37,12 56.81,7.56 62.93,7.56 CN7.10
PG6
  Top 0.152: CN8.15 84.45,50.8 55.43,50.8 51.82,47.19 IC1.91
PG7
  Top 0.152: CN8.16 82.22,51.1 55.23,51.1 51.32,47.19 IC1.92
PG8
  Top 0.152: CN8.17 79.98,51.41 55.04,51.41 50.82,47.19 IC1.93
PG9
  Top 0.152: IC1.124 19.7,36.81 CN9.7
PG11
  Top 0.152: IC1.126 18.16,35.81 CN9.8
PG12
  Top 0.152: IC1.127 18.16,35.31 CN9.9
PG13
  Top 0.152: IC1.128 20.2,34.81 CN9.10
PG14
  Top 0.152: IC1.129 22.25,34.31 CN9.11
PG15
  Top 0.152: IC1.132 37.88,32.81 37.64,32.57 23.05,32.57 CN9.12
SD_CD  (via drill 0.4 pad 0.7)
  Top 0.152: v56.11,52.91 44.37,52.91 41.15,56.13 14.22,56.13 12.19,58.17 v12.19,61.68 | v61.18,32.51 61.34,32.51 61.64,32.81 IC1.49
  Bottom 0.152: v61.18,32.51 60.73,32.51 59.12,33.73 59.12,38.97 56.54,41.94 56.54,47.84 56.42,47.96 56.42,52.6 v56.11,52.91 | R26.1 v12.19,61.68 12.19,61.82 12.41,62.04 CN4.CD
SD_CMD  (via drill 0.4 pad 0.7)
  Top 0.152: IC1.116 38.74,40.81 v38.31,41.24
  Bottom 0.152: CN4.2 27.81,62.04 27.69,61.91 R28.1 27.69,60.16 28.07,59.78 33.31,59.78 35.35,57.75 35.35,44.2 v38.31,41.24
SD_DAT0  (via drill 0.4 pad 0.7)
  Top 0.152: IC1.98 48.32,45.13 46.97,43.78 v42.86,43.78
  Bottom 0.152: v42.86,43.78 39.74,40.66 29.22,40.66 18.6,51.28 18.6,55.46 15.49,58.56 R27.1 15.49,59.72 15.64,59.72 16.22,60.3 16.22,61.24 15.42,62.04 15.31,62.04 CN4.7
SD_DAT1  (via drill 0.4 pad 0.7)
  Top 0.152: IC1.99 47.82,47.84 44.8,50.86 v44.48,50.86
  Bottom 0.152: CN4.8 13.71,62.04 13.72,62.04 R31.1 13.72,60.16 11.65,60.16 7.64,56.15 4.02,56.15 3.41,56.76 3.41,62.66 18.41,77.66 29.22,77.66 44.48,62.4 v44.48,50.86
SD_DAT2  (via drill 0.4 pad 0.7)
  Top 0.152: IC1.111 v39.33,43.31
  Bottom 0.152: CN4.9 32.81,62.04 32.77,61.99 R32.1 33.45,60.74 39.33,54.85 v39.33,43.31
SD_DAT3  (via drill 0.4 pad 0.7)
  Top 0.152: IC1.112 40.44,42.81 40.32,42.69 37.68,42.69 v37.47,42.9
  Bottom 0.152: CN4.1 30.31,62.04 30.23,61.95 R30.1 30.23,60.16 33.36,60.16 37.47,56.05 v37.47,42.9
SD_SCLK  (via drill 0.4 pad 0.7)
  Top 0.152: v23.36,47.34 31.79,47.34 36.82,42.31 IC1.113
  Bottom 0.152: v23.36,47.34 19.63,51.07 19.63,59.62 20.18,60.16 20.32,60.16 R29.1 20.32,62.03 20.31,62.04 CN4.5
VBAT
  Top 0.254: R25.2 R33.2 40.64,24.04 42.64,26.04 45.82,26.04 IC1.6
VCC  (via drill 0.4 pad 0.7, 0.6)
  Top 0.254: 24.85,22.87 24.26,22.28 IC5.3 | 24.85,22.87 C30.1 25.48,23.62 25.48,23.86 31.34,29.72 R34.2 | 37.12,21.87 35.15,21.87 31.3,18.02 28.08,18.02 26.24,19.86 26.24,21.99 25.35,22.87 24.85,22.87 | 37.12,21.87 37.19,21.81 R25.1 | 37.12,21.87 C16.1 40.25,26.67 40.39,26.81 IC1.144 44.1,26.81 45.75,28.84 | IC4.16 72.52,69.6 72.22,69.3 C29.1 70.87,68.67 65.98,63.79 64.58,63.79 64.09,64.28 64.09,64.52 C24.1 62.83,64.52 62.68,64.36 IC3.33 51.78,64.36 50.97,65.18 IC3.11 48.57,65.18 48.42,65.02 C23.1 47.16,65.02 47.16,68.75 46.82,69.09 R13.2 45.56,69.09 42.68,71.97 37.23,71.97 36.96,71.69 36.96,68.17 33.72,64.93 32.11,64.93 29.96,67.08 | Q1.3 27.6,71.46 27.85,71.46 29.96,69.34 | 29.96,67.08 23.44,67.08 21.73,65.37 21.68,65.37 21.34,65.02 21.34,57.4 | 29.96,67.08 29.96,69.34 | C7.1 66.39,27.94 66.26,27.81 IC1.39 61.59,27.81 60.09,29.31 59.69,29.31 | v34.74,41.24 35.47,41.24 37.12,39.59 C14.1 37.75,38.86 38.3,38.31 IC1.121 42.55,38.31 43.32,37.54 | 42.76,49.46 42.08,50.14 v34.74,50.14 | IC1.108 43.32,48.91 42.76,49.46 | 42.76,49.46 43.18,49.88 C13.1 | C11.1 C12.1 49.78,49.88 49.82,49.84 IC1.95 49.82,45.08 50.21,44.56 | 89.78,35.44 89.78,35.32 CN12.10 | CN12.9 89.78,35.8 89.78,35.44 | CN12.17 89.32,15.02 R9.2 71.37,14.39 70.75,14.39 69.3,12.95 L1.1 | C6.1 51.31,24.95 IC1.17 51.32,26.04 51.39,26.11 51.39,26.66 | C15.1 40.35,33.27 40.39,33.31 IC1.131 42.55,33.31 | 69.28,35.7 68.82,35.7 67.65,34.53 67.65,34.29 C8.1 66.39,34.29 66.33,34.24 63.71,34.24 63.63,34.31 IC1.52 60.22,34.31 59.69,33.78 59.69,29.31 | R6.2 29.96,69.34 | 59.69,29.31 54.04,29.31 51.39,26.66 | C10.1 66.01,44.2 v65.9,44.31 IC1.72
  Top 0.254: 51.39,26.66 49.6,28.84 45.75,28.84 | 45.75,28.84 45.75,30.11 42.55,33.31 | 43.32,37.54 43.44,37.42 43.44,34.2 42.55,33.31 | 50.21,44.56 43.32,37.54 | IC1.62 65.94,39.31 66.39,38.86 C9.1 67.65,38.86 67.65,39.1 68.14,39.59 69.12,39.59 69.28,39.43 69.28,35.7 | 89.78,35.44 69.53,35.44 69.28,35.7 | 50.21,44.56 50.66,43.99 54.62,43.99 55.32,44.94 IC1.84 | 21.34,57.4 20.83,56.9 14.99,56.9 v14.48,57.4 | 21.34,57.4 v22.1,57.4
  Top 0.406: 17.53,81.44 18.7,81.44 18.99,81.15 C3.A 21.21,82.3 24.89,82.3 25.68,81.51 IC2.2 | 17.53,81.44 2.65,67.32 2.65,35.84 CN2.2 CN2.1 | C4.1 17.53,81.44
  Bottom 0.254: R27.2 14.76,60.74 14.76,60.47 14.07,59.77 13.72,59.77 R31.2 | CN4.4 22.81,61.42 22.86,61.37 C31.1 22.13,60.74 22.13,60.23 21.33,59.42 | R31.2 R26.2 12.19,40.53 6.99,35.32 CN2.1 | CN12.9 CN12.8 | CN12.17 CN12.16 CN12.15 CN12.14 CN12.13 CN12.12 CN12.11 89.78,32.78 89.78,33.26 | R29.2 21.05,59.14 21.33,59.42 | 22.24,58.51 27.69,58.51 R28.2 R30.2 R32.2 32.77,52.12 v34.74,50.14 v34.74,41.24 | 22.24,58.51 21.33,59.42 | v65.9,44.31 74.41,35.8 85.67,35.8 87.14,34.34 87.14,33.93 87.81,33.26 89.78,33.26 | 89.78,33.26 CN12.10 | v14.48,57.4 14.48,58.38 R31.2 | v22.1,57.4 22.1,58.38 22.24,58.51
VDDA
  Top 0.254: IC1.33 59.32,20.5 R8.1 61.76,17.78 C17.A 63.88,15.84 C5.1 64.48,13.79 64.53,13.73 L1.2

## Text on the board
Top: ZKHF
Bottom: mcs-1-32, 2015-05-31, SUN GE
tPlace: USB | RS232 | Vehicle Controller | Hub Board | JTAG | GNDs | 5V | PG8 | PC6 | PG7 | 5V | PC7 | PG6 | 5V | PA8 | PB15 | 5V | PD3 | PB14 | 5V | PD6 | PB13 | 5V | PD7 | PB12 | 5V | PG9 | PB11 | 3V3 | PG11 | PB10 | 3V3 | PG12 | PB1 | 3V3 | PG13 | PB0 | 3V3 | PG14 | 3V3 | PC5 | PG15 | PC4 | 3V3 | GND | PB5 | 3V3 | PA7 | STM32 | LC | PB6 | PA6 | 3V3 | 3V3 | LA | PB7 | PA5 | LV | PA4 | 3V3 | GNDs | PE2 | PE3 | PE4 | PE5 | PE6 | PC13 | PF7 | PF8 | PF9 | PF10 | PC0 | PC1 | PC2 | PC3 | PA0 | PA1 | PA2 | PA3 | CAN | GNDs
bPlace: SD CARD